# Altium project WS2812B.PrjPcb
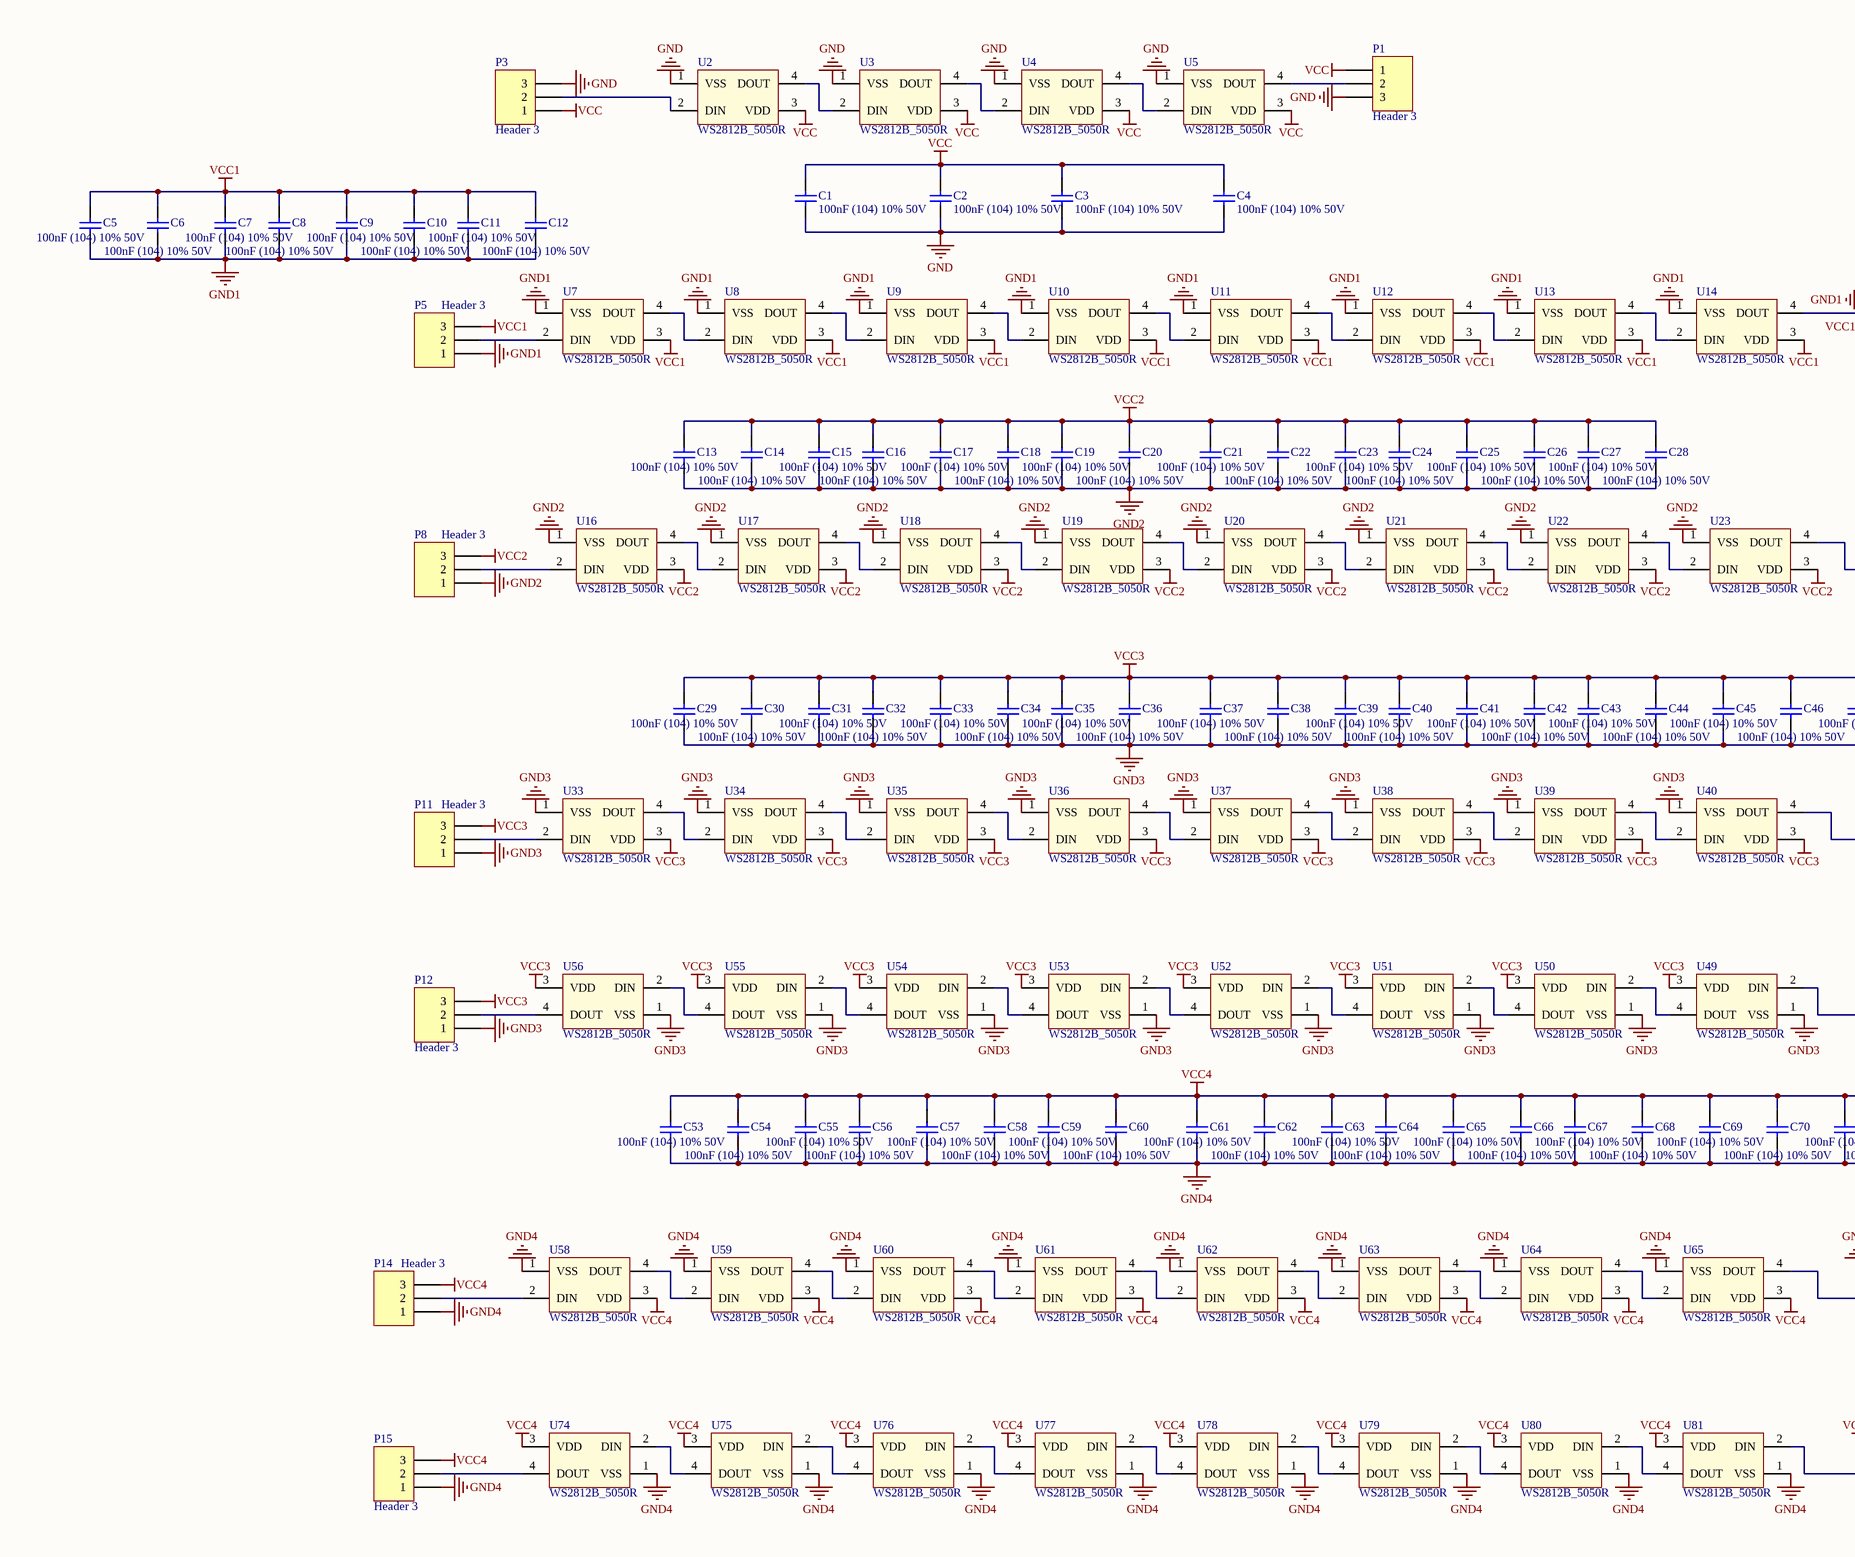
[diagram p0: WS2812B.SchDoc, left]
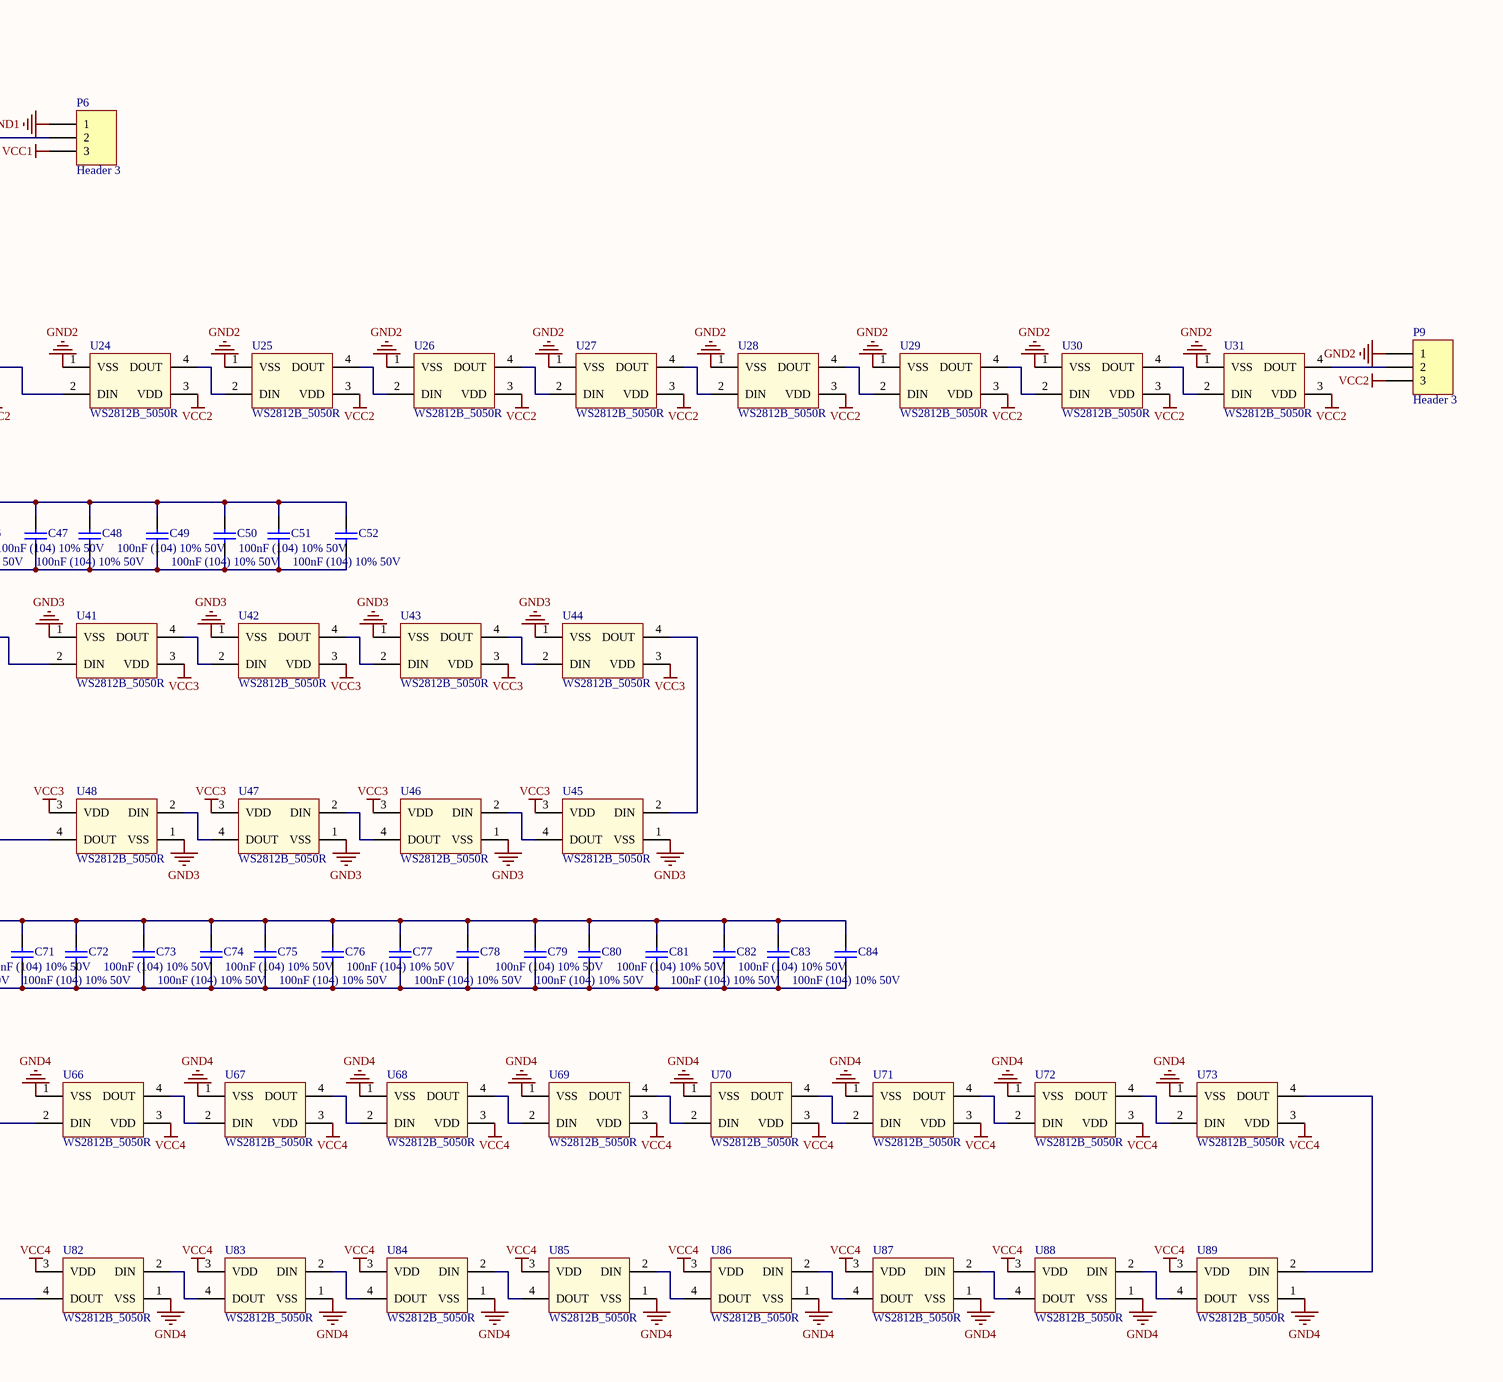
[diagram p1: WS2812B.SchDoc, right]
1 sheet, 178 parts. Net scope: global (net labels, ports and power ports of the same name join across sheets).
Board file: WS2812B.PcbDoc

## Sheet WS2812B.SchDoc
size A1

### Parts
C1  100nF (104) 10% 50V  [0603_C]
C2  100nF (104) 10% 50V  [0603_C]
C3  100nF (104) 10% 50V  [0603_C]
C4  100nF (104) 10% 50V  [0603_C]
C5  100nF (104) 10% 50V  [0603_C]
C6  100nF (104) 10% 50V  [0603_C]
C7  100nF (104) 10% 50V  [0603_C]
C8  100nF (104) 10% 50V  [0603_C]
C9  100nF (104) 10% 50V  [0603_C]
C10  100nF (104) 10% 50V  [0603_C]
C11  100nF (104) 10% 50V  [0603_C]
C12  100nF (104) 10% 50V  [0603_C]
C13  100nF (104) 10% 50V  [0603_C]
C14  100nF (104) 10% 50V  [0603_C]
C15  100nF (104) 10% 50V  [0603_C]
C16  100nF (104) 10% 50V  [0603_C]
C17  100nF (104) 10% 50V  [0603_C]
C18  100nF (104) 10% 50V  [0603_C]
C19  100nF (104) 10% 50V  [0603_C]
C20  100nF (104) 10% 50V  [0603_C]
C21  100nF (104) 10% 50V  [0603_C]
C22  100nF (104) 10% 50V  [0603_C]
C23  100nF (104) 10% 50V  [0603_C]
C24  100nF (104) 10% 50V  [0603_C]
C25  100nF (104) 10% 50V  [0603_C]
C26  100nF (104) 10% 50V  [0603_C]
C27  100nF (104) 10% 50V  [0603_C]
C28  100nF (104) 10% 50V  [0603_C]
C29  100nF (104) 10% 50V  [0603_C]
C30  100nF (104) 10% 50V  [0603_C]
C31  100nF (104) 10% 50V  [0603_C]
C32  100nF (104) 10% 50V  [0603_C]
C33  100nF (104) 10% 50V  [0603_C]
C34  100nF (104) 10% 50V  [0603_C]
C35  100nF (104) 10% 50V  [0603_C]
C36  100nF (104) 10% 50V  [0603_C]
C37  100nF (104) 10% 50V  [0603_C]
C38  100nF (104) 10% 50V  [0603_C]
C39  100nF (104) 10% 50V  [0603_C]
C40  100nF (104) 10% 50V  [0603_C]
C41  100nF (104) 10% 50V  [0603_C]
C42  100nF (104) 10% 50V  [0603_C]
C43  100nF (104) 10% 50V  [0603_C]
C44  100nF (104) 10% 50V  [0603_C]
C45  100nF (104) 10% 50V  [0603_C]
C46  100nF (104) 10% 50V  [0603_C]
C47  100nF (104) 10% 50V  [0603_C]
C48  100nF (104) 10% 50V  [0603_C]
C49  100nF (104) 10% 50V  [0603_C]
C50  100nF (104) 10% 50V  [0603_C]
C51  100nF (104) 10% 50V  [0603_C]
C52  100nF (104) 10% 50V  [0603_C]
C53  100nF (104) 10% 50V  [0603_C]
C54  100nF (104) 10% 50V  [0603_C]
C55  100nF (104) 10% 50V  [0603_C]
C56  100nF (104) 10% 50V  [0603_C]
C57  100nF (104) 10% 50V  [0603_C]
C58  100nF (104) 10% 50V  [0603_C]
C59  100nF (104) 10% 50V  [0603_C]
C60  100nF (104) 10% 50V  [0603_C]
C61  100nF (104) 10% 50V  [0603_C]
C62  100nF (104) 10% 50V  [0603_C]
C63  100nF (104) 10% 50V  [0603_C]
C64  100nF (104) 10% 50V  [0603_C]
C65  100nF (104) 10% 50V  [0603_C]
C66  100nF (104) 10% 50V  [0603_C]
C67  100nF (104) 10% 50V  [0603_C]
C68  100nF (104) 10% 50V  [0603_C]
C69  100nF (104) 10% 50V  [0603_C]
C70  100nF (104) 10% 50V  [0603_C]
C71  100nF (104) 10% 50V  [0603_C]
C72  100nF (104) 10% 50V  [0603_C]
C73  100nF (104) 10% 50V  [0603_C]
C74  100nF (104) 10% 50V  [0603_C]
C75  100nF (104) 10% 50V  [0603_C]
C76  100nF (104) 10% 50V  [0603_C]
C77  100nF (104) 10% 50V  [0603_C]
C78  100nF (104) 10% 50V  [0603_C]
C79  100nF (104) 10% 50V  [0603_C]
C80  100nF (104) 10% 50V  [0603_C]
C81  100nF (104) 10% 50V  [0603_C]
C82  100nF (104) 10% 50V  [0603_C]
C83  100nF (104) 10% 50V  [0603_C]
C84  100nF (104) 10% 50V  [0603_C]
P1  Header 3  [PIN3_SMT]
P3  Header 3  [PIN3_SMT]
P5  Header 3  [PIN3_SMT]
P6  Header 3  [PIN3_SMT]
P8  Header 3  [PIN3_SMT]
P9  Header 3  [PIN3_SMT]
P11  Header 3  [PIN3_SMT]
P12  Header 3  [PIN3_SMT]
P14  Header 3  [PIN3_SMT]
P15  Header 3  [PIN3_SMT]
U2  WS2812B_5050R  [SW2812B_5050RGB]
U3  WS2812B_5050R  [SW2812B_5050RGB]
U4  WS2812B_5050R  [SW2812B_5050RGB]
U5  WS2812B_5050R  [SW2812B_5050RGB]
U7  WS2812B_5050R  [SW2812B_5050RGB]
U8  WS2812B_5050R  [SW2812B_5050RGB]
U9  WS2812B_5050R  [SW2812B_5050RGB]
U10  WS2812B_5050R  [SW2812B_5050RGB]
U11  WS2812B_5050R  [SW2812B_5050RGB]
U12  WS2812B_5050R  [SW2812B_5050RGB]
U13  WS2812B_5050R  [SW2812B_5050RGB]
U14  WS2812B_5050R  [SW2812B_5050RGB]
U16  WS2812B_5050R  [SW2812B_5050RGB]
U17  WS2812B_5050R  [SW2812B_5050RGB]
U18  WS2812B_5050R  [SW2812B_5050RGB]
U19  WS2812B_5050R  [SW2812B_5050RGB]
U20  WS2812B_5050R  [SW2812B_5050RGB]
U21  WS2812B_5050R  [SW2812B_5050RGB]
U22  WS2812B_5050R  [SW2812B_5050RGB]
U23  WS2812B_5050R  [SW2812B_5050RGB]
U24  WS2812B_5050R  [SW2812B_5050RGB]
U25  WS2812B_5050R  [SW2812B_5050RGB]
U26  WS2812B_5050R  [SW2812B_5050RGB]
U27  WS2812B_5050R  [SW2812B_5050RGB]
U28  WS2812B_5050R  [SW2812B_5050RGB]
U29  WS2812B_5050R  [SW2812B_5050RGB]
U30  WS2812B_5050R  [SW2812B_5050RGB]
U31  WS2812B_5050R  [SW2812B_5050RGB]
U33  WS2812B_5050R  [SW2812B_5050RGB]
U34  WS2812B_5050R  [SW2812B_5050RGB]
U35  WS2812B_5050R  [SW2812B_5050RGB]
U36  WS2812B_5050R  [SW2812B_5050RGB]
U37  WS2812B_5050R  [SW2812B_5050RGB]
U38  WS2812B_5050R  [SW2812B_5050RGB]
U39  WS2812B_5050R  [SW2812B_5050RGB]
U40  WS2812B_5050R  [SW2812B_5050RGB]
U41  WS2812B_5050R  [SW2812B_5050RGB]
U42  WS2812B_5050R  [SW2812B_5050RGB]
U43  WS2812B_5050R  [SW2812B_5050RGB]
U44  WS2812B_5050R  [SW2812B_5050RGB]
U45  WS2812B_5050R  [SW2812B_5050RGB]
U46  WS2812B_5050R  [SW2812B_5050RGB]
U47  WS2812B_5050R  [SW2812B_5050RGB]
U48  WS2812B_5050R  [SW2812B_5050RGB]
U49  WS2812B_5050R  [SW2812B_5050RGB]
U50  WS2812B_5050R  [SW2812B_5050RGB]
U51  WS2812B_5050R  [SW2812B_5050RGB]
U52  WS2812B_5050R  [SW2812B_5050RGB]
U53  WS2812B_5050R  [SW2812B_5050RGB]
U54  WS2812B_5050R  [SW2812B_5050RGB]
U55  WS2812B_5050R  [SW2812B_5050RGB]
U56  WS2812B_5050R  [SW2812B_5050RGB]
U58  WS2812B_5050R  [SW2812B_5050RGB]
U59  WS2812B_5050R  [SW2812B_5050RGB]
U60  WS2812B_5050R  [SW2812B_5050RGB]
U61  WS2812B_5050R  [SW2812B_5050RGB]
U62  WS2812B_5050R  [SW2812B_5050RGB]
U63  WS2812B_5050R  [SW2812B_5050RGB]
U64  WS2812B_5050R  [SW2812B_5050RGB]
U65  WS2812B_5050R  [SW2812B_5050RGB]
U66  WS2812B_5050R  [SW2812B_5050RGB]
U67  WS2812B_5050R  [SW2812B_5050RGB]
U68  WS2812B_5050R  [SW2812B_5050RGB]
U69  WS2812B_5050R  [SW2812B_5050RGB]
U70  WS2812B_5050R  [SW2812B_5050RGB]
U71  WS2812B_5050R  [SW2812B_5050RGB]
U72  WS2812B_5050R  [SW2812B_5050RGB]
U73  WS2812B_5050R  [SW2812B_5050RGB]
U74  WS2812B_5050R  [SW2812B_5050RGB]
U75  WS2812B_5050R  [SW2812B_5050RGB]
U76  WS2812B_5050R  [SW2812B_5050RGB]
U77  WS2812B_5050R  [SW2812B_5050RGB]
U78  WS2812B_5050R  [SW2812B_5050RGB]
U79  WS2812B_5050R  [SW2812B_5050RGB]
U80  WS2812B_5050R  [SW2812B_5050RGB]
U81  WS2812B_5050R  [SW2812B_5050RGB]
U82  WS2812B_5050R  [SW2812B_5050RGB]
U83  WS2812B_5050R  [SW2812B_5050RGB]
U84  WS2812B_5050R  [SW2812B_5050RGB]
U85  WS2812B_5050R  [SW2812B_5050RGB]
U86  WS2812B_5050R  [SW2812B_5050RGB]
U87  WS2812B_5050R  [SW2812B_5050RGB]
U88  WS2812B_5050R  [SW2812B_5050RGB]
U89  WS2812B_5050R  [SW2812B_5050RGB]

### Nets
GND: C1.1 C2.1 C3.1 C4.1 P1.3 P3.3 U2.1(VSS) U3.1(VSS) U4.1(VSS) U5.1(VSS)
GND1: C5.1 C6.1 C7.1 C8.1 C9.1 C10.1 C11.1 C12.1 P5.1 P6.1 U7.1(VSS) U8.1(VSS) U9.1(VSS) U10.1(VSS) U11.1(VSS) U12.1(VSS) U13.1(VSS) U14.1(VSS)
GND2: C13.1 C14.1 C15.1 C16.1 C17.1 C18.1 C19.1 C20.1 C21.1 C22.1 C23.1 C24.1 C25.1 C26.1 C27.1 C28.1 P8.1 P9.1 U16.1(VSS) U17.1(VSS) U18.1(VSS) U19.1(VSS) U20.1(VSS) U21.1(VSS) U22.1(VSS) U23.1(VSS) U24.1(VSS) U25.1(VSS) U26.1(VSS) U27.1(VSS) U28.1(VSS) U29.1(VSS) U30.1(VSS) U31.1(VSS)
GND3: C29.1 C30.1 C31.1 C32.1 C33.1 C34.1 C35.1 C36.1 C37.1 C38.1 C39.1 C40.1 C41.1 C42.1 C43.1 C44.1 C45.1 C46.1 C47.1 C48.1 C49.1 C50.1 C51.1 C52.1 P11.1 P12.1 U33.1(VSS) U34.1(VSS) U35.1(VSS) U36.1(VSS) U37.1(VSS) U38.1(VSS) U39.1(VSS) U40.1(VSS) U41.1(VSS) U42.1(VSS) U43.1(VSS) U44.1(VSS) U45.1(VSS) U46.1(VSS) U47.1(VSS) U48.1(VSS) U49.1(VSS) U50.1(VSS) U51.1(VSS) U52.1(VSS) U53.1(VSS) U54.1(VSS) U55.1(VSS) U56.1(VSS)
GND4: C53.1 C54.1 C55.1 C56.1 C57.1 C58.1 C59.1 C60.1 C61.1 C62.1 C63.1 C64.1 C65.1 C66.1 C67.1 C68.1 C69.1 C70.1 C71.1 C72.1 C73.1 C74.1 C75.1 C76.1 C77.1 C78.1 C79.1 C80.1 C81.1 C82.1 C83.1 C84.1 P14.1 P15.1 U58.1(VSS) U59.1(VSS) U60.1(VSS) U61.1(VSS) U62.1(VSS) U63.1(VSS) U64.1(VSS) U65.1(VSS) U66.1(VSS) U67.1(VSS) U68.1(VSS) U69.1(VSS) U70.1(VSS) U71.1(VSS) U72.1(VSS) U73.1(VSS) U74.1(VSS) U75.1(VSS) U76.1(VSS) U77.1(VSS) U78.1(VSS) U79.1(VSS) U80.1(VSS) U81.1(VSS) U82.1(VSS) U83.1(VSS) U84.1(VSS) U85.1(VSS) U86.1(VSS) U87.1(VSS) U88.1(VSS) U89.1(VSS)
VCC: C1.2 C2.2 C3.2 C4.2 P1.1 P3.1 U2.3(VDD) U3.3(VDD) U4.3(VDD) U5.3(VDD)
VCC1: C5.2 C6.2 C7.2 C8.2 C9.2 C10.2 C11.2 C12.2 P5.3 P6.3 U7.3(VDD) U8.3(VDD) U9.3(VDD) U10.3(VDD) U11.3(VDD) U12.3(VDD) U13.3(VDD) U14.3(VDD)
VCC2: C13.2 C14.2 C15.2 C16.2 C17.2 C18.2 C19.2 C20.2 C21.2 C22.2 C23.2 C24.2 C25.2 C26.2 C27.2 C28.2 P8.3 P9.3 U16.3(VDD) U17.3(VDD) U18.3(VDD) U19.3(VDD) U20.3(VDD) U21.3(VDD) U22.3(VDD) U23.3(VDD) U24.3(VDD) U25.3(VDD) U26.3(VDD) U27.3(VDD) U28.3(VDD) U29.3(VDD) U30.3(VDD) U31.3(VDD)
VCC3: C29.2 C30.2 C31.2 C32.2 C33.2 C34.2 C35.2 C36.2 C37.2 C38.2 C39.2 C40.2 C41.2 C42.2 C43.2 C44.2 C45.2 C46.2 C47.2 C48.2 C49.2 C50.2 C51.2 C52.2 P11.3 P12.3 U33.3(VDD) U34.3(VDD) U35.3(VDD) U36.3(VDD) U37.3(VDD) U38.3(VDD) U39.3(VDD) U40.3(VDD) U41.3(VDD) U42.3(VDD) U43.3(VDD) U44.3(VDD) U45.3(VDD) U46.3(VDD) U47.3(VDD) U48.3(VDD) U49.3(VDD) U50.3(VDD) U51.3(VDD) U52.3(VDD) U53.3(VDD) U54.3(VDD) U55.3(VDD) U56.3(VDD)
VCC4: C53.2 C54.2 C55.2 C56.2 C57.2 C58.2 C59.2 C60.2 C61.2 C62.2 C63.2 C64.2 C65.2 C66.2 C67.2 C68.2 C69.2 C70.2 C71.2 C72.2 C73.2 C74.2 C75.2 C76.2 C77.2 C78.2 C79.2 C80.2 C81.2 C82.2 C83.2 C84.2 P14.3 P15.3 U58.3(VDD) U59.3(VDD) U60.3(VDD) U61.3(VDD) U62.3(VDD) U63.3(VDD) U64.3(VDD) U65.3(VDD) U66.3(VDD) U67.3(VDD) U68.3(VDD) U69.3(VDD) U70.3(VDD) U71.3(VDD) U72.3(VDD) U73.3(VDD) U74.3(VDD) U75.3(VDD) U76.3(VDD) U77.3(VDD) U78.3(VDD) U79.3(VDD) U80.3(VDD) U81.3(VDD) U82.3(VDD) U83.3(VDD) U84.3(VDD) U85.3(VDD) U86.3(VDD) U87.3(VDD) U88.3(VDD) U89.3(VDD)
NetP1_2: P1.2 U5.4(DOUT)
NetP3_2: P3.2 U2.2(DIN)
NetP5_2: P5.2 U7.2(DIN)
NetP6_2: P6.2 U14.4(DOUT)
NetP8_2: P8.2 U16.2(DIN)
NetP9_2: P9.2 U31.4(DOUT)
NetP11_2: P11.2 U33.2(DIN)
NetP12_2: P12.2 U56.4(DOUT)
NetP14_2: P14.2 U58.2(DIN)
NetP15_2: P15.2 U74.4(DOUT)
NetU2_4: U2.4(DOUT) U3.2(DIN)
NetU3_4: U3.4(DOUT) U4.2(DIN)
NetU4_4: U4.4(DOUT) U5.2(DIN)
NetU7_4: U7.4(DOUT) U8.2(DIN)
NetU8_4: U8.4(DOUT) U9.2(DIN)
NetU9_4: U9.4(DOUT) U10.2(DIN)
NetU10_4: U10.4(DOUT) U11.2(DIN)
NetU11_4: U11.4(DOUT) U12.2(DIN)
NetU12_4: U12.4(DOUT) U13.2(DIN)
NetU13_4: U13.4(DOUT) U14.2(DIN)
NetU16_4: U16.4(DOUT) U17.2(DIN)
NetU17_4: U17.4(DOUT) U18.2(DIN)
NetU18_4: U18.4(DOUT) U19.2(DIN)
NetU19_4: U19.4(DOUT) U20.2(DIN)
NetU20_4: U20.4(DOUT) U21.2(DIN)
NetU21_4: U21.4(DOUT) U22.2(DIN)
NetU22_4: U22.4(DOUT) U23.2(DIN)
NetU23_4: U23.4(DOUT) U24.2(DIN)
NetU24_4: U24.4(DOUT) U25.2(DIN)
NetU25_4: U25.4(DOUT) U26.2(DIN)
NetU26_4: U26.4(DOUT) U27.2(DIN)
NetU27_4: U27.4(DOUT) U28.2(DIN)
NetU28_4: U28.4(DOUT) U29.2(DIN)
NetU29_4: U29.4(DOUT) U30.2(DIN)
NetU30_4: U30.4(DOUT) U31.2(DIN)
NetU33_4: U33.4(DOUT) U34.2(DIN)
NetU34_4: U34.4(DOUT) U35.2(DIN)
NetU35_4: U35.4(DOUT) U36.2(DIN)
NetU36_4: U36.4(DOUT) U37.2(DIN)
NetU37_4: U37.4(DOUT) U38.2(DIN)
NetU38_4: U38.4(DOUT) U39.2(DIN)
NetU39_4: U39.4(DOUT) U40.2(DIN)
NetU40_4: U40.4(DOUT) U41.2(DIN)
NetU41_4: U41.4(DOUT) U42.2(DIN)
NetU42_4: U42.4(DOUT) U43.2(DIN)
NetU43_4: U43.4(DOUT) U44.2(DIN)
NetU44_4: U44.4(DOUT) U45.2(DIN)
NetU45_4: U45.4(DOUT) U46.2(DIN)
NetU46_4: U46.4(DOUT) U47.2(DIN)
NetU47_4: U47.4(DOUT) U48.2(DIN)
NetU48_4: U48.4(DOUT) U49.2(DIN)
NetU49_4: U49.4(DOUT) U50.2(DIN)
NetU50_4: U50.4(DOUT) U51.2(DIN)
NetU51_4: U51.4(DOUT) U52.2(DIN)
NetU52_4: U52.4(DOUT) U53.2(DIN)
NetU53_4: U53.4(DOUT) U54.2(DIN)
NetU54_4: U54.4(DOUT) U55.2(DIN)
NetU55_4: U55.4(DOUT) U56.2(DIN)
NetU58_4: U58.4(DOUT) U59.2(DIN)
NetU59_4: U59.4(DOUT) U60.2(DIN)
NetU60_4: U60.4(DOUT) U61.2(DIN)
NetU61_4: U61.4(DOUT) U62.2(DIN)
NetU62_4: U62.4(DOUT) U63.2(DIN)
NetU63_4: U63.4(DOUT) U64.2(DIN)
NetU64_4: U64.4(DOUT) U65.2(DIN)
NetU65_4: U65.4(DOUT) U66.2(DIN)
NetU66_4: U66.4(DOUT) U67.2(DIN)
NetU67_4: U67.4(DOUT) U68.2(DIN)
NetU68_4: U68.4(DOUT) U69.2(DIN)
NetU69_4: U69.4(DOUT) U70.2(DIN)
NetU70_4: U70.4(DOUT) U71.2(DIN)
NetU71_4: U71.4(DOUT) U72.2(DIN)
NetU72_4: U72.4(DOUT) U73.2(DIN)
NetU73_4: U73.4(DOUT) U89.2(DIN)
NetU74_2: U74.2(DIN) U75.4(DOUT)
NetU75_2: U75.2(DIN) U76.4(DOUT)
NetU76_2: U76.2(DIN) U77.4(DOUT)
NetU77_2: U77.2(DIN) U78.4(DOUT)
NetU78_2: U78.2(DIN) U79.4(DOUT)
NetU79_2: U79.2(DIN) U80.4(DOUT)
NetU80_2: U80.2(DIN) U81.4(DOUT)
NetU81_2: U81.2(DIN) U82.4(DOUT)
NetU82_2: U82.2(DIN) U83.4(DOUT)
NetU83_2: U83.2(DIN) U84.4(DOUT)
NetU84_2: U84.2(DIN) U85.4(DOUT)
NetU85_2: U85.2(DIN) U86.4(DOUT)
NetU86_2: U86.2(DIN) U87.4(DOUT)
NetU87_2: U87.2(DIN) U88.4(DOUT)
NetU88_2: U88.2(DIN) U89.4(DOUT)

### Library data of the parts
C1-C84 = 0603 100nF (104) 10% 50V: 贴片电容; ComponentLink1Description: 供应商链接; ComponentLink1URL: http://www.szlcsc.com/product/details_15331.html; Package: 0603; Supplier: LC; SuppliersPartNumber: C14663
P1 P3 P5 P6 P8 P9 P11 P12 P14 P15 = Header 3: Header, 3-Pin; LatestRevisionDate: 17-Jul-2002; LatestRevisionNote: Re-released for DXP Platform.; Publisher: Altium Limited
U2-U5 U7-U14 U16-U31 U33-U56 U58-U89 = WS2812B_5050RGB